# EAGLE design pll_board (EAGLE 8.3.0)
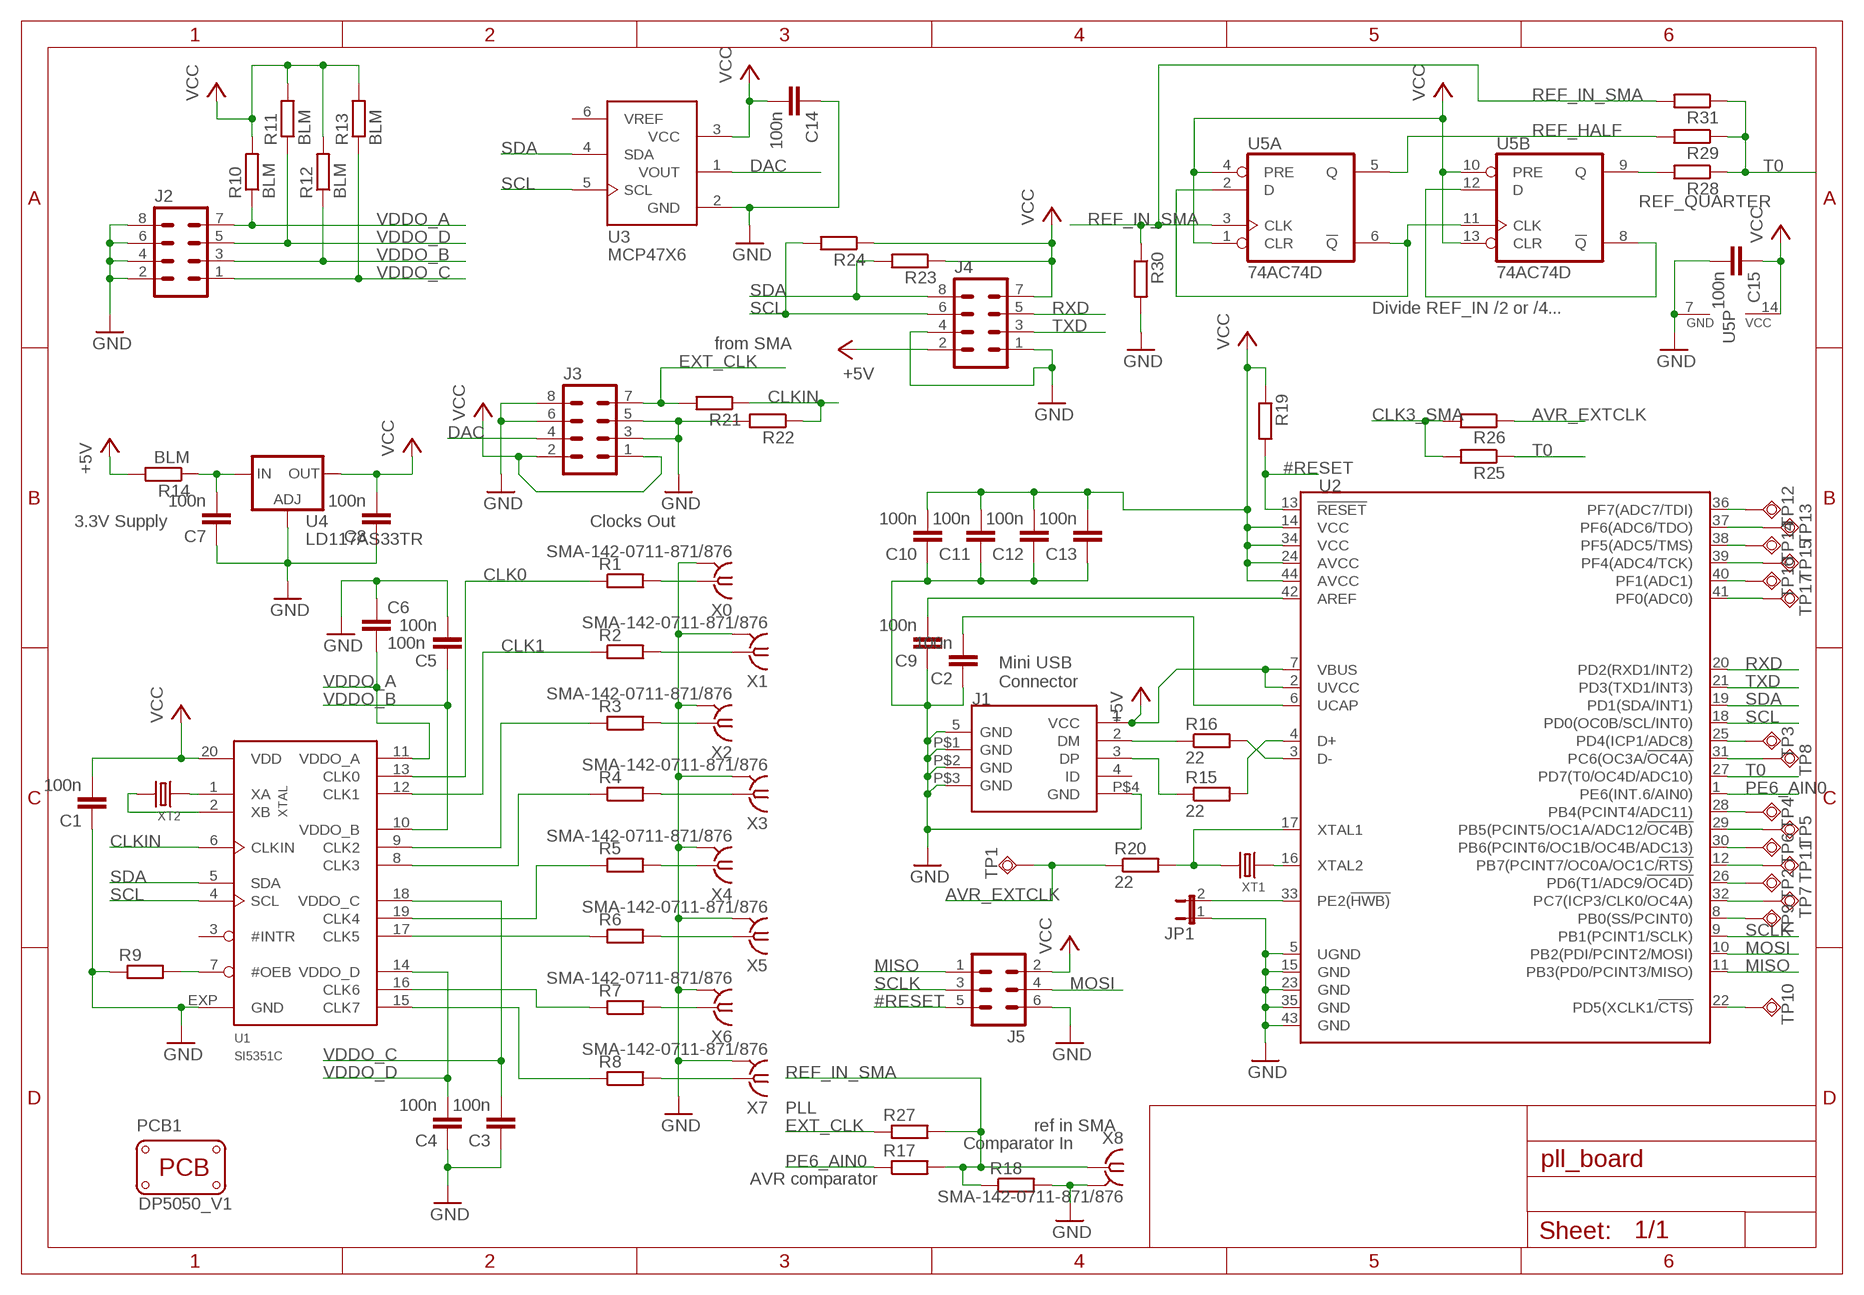
[diagram p0: schematic, sheet 1]

## Parts
C1  100n  C-EUC0805  [C0805]
C2  100n  C-EUC0805  [C0805]
C3  100n  C-EUC0805  [C0805]
C4  100n  C-EUC0805  [C0805]
C5  100n  C-EUC0805  [C0805]
C6  100n  C-EUC0805  [C0805]
C7  100n  C-EUC0805  [C0805]
C8  100n  C-EUC0805  [C0805]
C9  100n  C-EUC0805  [C0805]
C10  100n  C-EUC0805  [C0805]
C11  100n  C-EUC0805  [C0805]
C12  100n  C-EUC0805  [C0805]
C13  100n  C-EUC0805  [C0805]
C14  100n  C-EUC0805  [C0805]
C15  100n  C-EUC0805  [C0805]
J1  MINI-USB-RCPT-B-5PS-R/A-SMD(ST-USB-002A)  [MINIUSB5+4P-SMD-0.8-90D]
J2  MA04-2  [MA04-2]
J3  MA04-2  [MA04-2]
J4  MA04-2  [MA04-2]
J5  MA03-2  [MA03-2]
JP1  JP1E  [JP1]
PCB1  PCB_DP_SQUARE-5X5  [DP5050_V1]
R1  R-EU_R0805  [R0805]
R2  R-EU_R0805  [R0805]
R3  R-EU_R0805  [R0805]
R4  R-EU_R0805  [R0805]
R5  R-EU_R0805  [R0805]
R6  R-EU_R0805  [R0805]
R7  R-EU_R0805  [R0805]
R8  R-EU_R0805  [R0805]
R9  R-EU_R0805  [R0805]
R10  BLM  R-EU_R0805  [R0805]
R11  BLM  R-EU_R0805  [R0805]
R12  BLM  R-EU_R0805  [R0805]
R13  BLM  R-EU_R0805  [R0805]
R14  BLM  R-EU_R0805  [R0805]
R15  22  R-EU_R0805  [R0805]
R16  22  R-EU_R0805  [R0805]
R17  R-EU_R0805  [R0805]
R18  R-EU_R0805  [R0805]
R19  R-EU_R0805  [R0805]
R20  22  R-EU_R0805  [R0805]
R21  R-EU_R0805  [R0805]
R22  R-EU_R0805  [R0805]
R23  R-EU_R0805  [R0805]
R24  R-EU_R0805  [R0805]
R25  R-EU_R0805  [R0805]
R26  R-EU_R0805  [R0805]
R27  R-EU_R0805  [R0805]
R28  R-EU_R0805  [R0805]
R29  R-EU_R0805  [R0805]
R30  R-EU_R0805  [R0805]
R31  R-EU_R0805  [R0805]
TP1  TPSQB1,27  [B1,27]
TP2  TPSQB1,27  [B1,27]
TP3  TPSQB1,27  [B1,27]
TP4  TPSQB1,27  [B1,27]
TP5  TPSQB1,27  [B1,27]
TP6  TPSQB1,27  [B1,27]
TP7  TPSQB1,27  [B1,27]
TP8  TPSQB1,27  [B1,27]
TP9  TPSQB1,27  [B1,27]
TP10  TPSQB1,27  [B1,27]
TP11  TPSQB1,27  [B1,27]
TP12  TPSQB1,27  [B1,27]
TP13  TPSQB1,27  [B1,27]
TP14  TPSQB1,27  [B1,27]
TP15  TPSQB1,27  [B1,27]
TP16  TPSQB1,27  [B1,27]
TP17  TPSQB1,27  [B1,27]
U1  SI5351C  [QFN20]
U2  MCU-ATMEGA32U4(TQFP44)-AU  [TQFP44-0.8-9.6X9.6MM]
U3  MCP47X6  [SOT23-6]
U4  LD117AS33TR  [SOT223]
U5  74AC74D  [SO14]
X0  SMA-142-0711-871/876  [J502-ND-142-0711-871/876]
X1  SMA-142-0711-871/876  [J502-ND-142-0711-871/876]
X2  SMA-142-0711-871/876  [J502-ND-142-0711-871/876]
X3  SMA-142-0711-871/876  [J502-ND-142-0711-871/876]
X4  SMA-142-0711-871/876  [J502-ND-142-0711-871/876]
X5  SMA-142-0711-871/876  [J502-ND-142-0711-871/876]
X6  SMA-142-0711-871/876  [J502-ND-142-0711-871/876]
X7  SMA-142-0711-871/876  [J502-ND-142-0711-871/876]
X8  SMA-142-0711-871/876  [J502-ND-142-0711-871/876]
XT1  CRYSTAL'3225'  [X4-SMD-3.2X2.5X0.7MM]
XT2  CRYSTAL'3225'  [X4-SMD-3.2X2.5X0.7MM]

## Nets
#OEB: R9.2 U1.7(#OEB)
#RESET: J5.5 R19.2 U2.13(!RESET)
+5V: J1.1(VCC) J4.2 R14.2 U2.2(UVCC) U2.7(VBUS)
AREF: C9.2 U2.42(AREF)
AVR_EXTCLK: R20.1 R26.1 TP1.TP
CLK0: R1.1 U1.13(CLK0)
CLK0_SMA: R1.2 X0.1
CLK1: R2.1 U1.12(CLK1)
CLK1_SMA: R2.2 X1.1
CLK2: R3.1 U1.9(CLK2)
CLK2_SMA: R3.2 X2.1
CLK3: R4.1 U1.8(CLK3)
CLK3_SMA: R4.2 R25.2 R26.2 X3.1
CLK4: R5.1 U1.19(CLK4)
CLK4_SMA: R5.2 X4.1
CLK5: R6.1 U1.17(CLK5)
CLK5_SMA: R6.2 X5.1
CLK6: R7.1 U1.16(CLK6)
CLK6_SMA: R7.2 X6.1
CLK7: R8.1 U1.15(CLK7)
CLK7_SMA: R8.2 X7.1
CLKIN: R21.1 R22.1 U1.6(CLKIN)
DAC: J3.4 U3.1(VOUT)
EXT_CLK: J3.7 R21.2 R27.1
GND: C1.1 C2.1 C3.1 C4.1 C5.2 C6.1 C7.1 C8.1 C9.1 C10.1 C11.1 C12.1 C13.1 C14.1 C15.2 J1.5(GND) J1.P$1(GND) J1.P$2(GND) J1.P$3(GND) J1.P$4(GND) J2.2 J2.4 J2.6 J2.8 J3.3 J3.5 J3.6 J3.8 J4.1 J4.4 J5.6 JP1.1 R9.1 R18.2 R22.2 R30.2 U1.EXP(GND) U2.5(UGND) U2.15(GND) U2.23(GND) U2.35(GND) U2.43(GND) U3.2(GND) U4.1(ADJ) U5.7(P:GND) X0.G@1 X0.G@2 X0.G@3 X0.G@4 X1.G@1 X1.G@2 X1.G@3 X1.G@4 X2.G@1 X2.G@2 X2.G@3 X2.G@4 X3.G@1 X3.G@2 X3.G@3 X3.G@4 X4.G@1 X4.G@2 X4.G@3 X4.G@4 X5.G@1 X5.G@2 X5.G@3 X5.G@4 X6.G@1 X6.G@2 X6.G@3 X6.G@4 X7.G@1 X7.G@2 X7.G@3 X7.G@4 X8.G@1 X8.G@2 X8.G@3 X8.G@4
LDO_IN: C7.2 R14.1 U4.3(IN)
MISO: J5.1 U2.11(PB3(PD0/PCINT3/MISO))
MOSI: J5.4 U2.10(PB2(PDI/PCINT2/MOSI))
N$1: U2.16(XTAL2) XT1.2
N$2: U1.1(XA) XT2.2
N$3: R20.2 U2.17(XTAL1) XT1.4
N$5: JP1.2 U2.33(PE2(!HWB))
N$11: U1.2(XB) XT2.4
P8: TP9.TP U2.8(PB0(SS/PCINT0))
P12: TP11.TP U2.12(PB7(PCINT7/OC0A/OC1C/!RTS))
P22: TP10.TP U2.22(PD5(XCLK1/!CTS))
P25: TP3.TP U2.25(PD4(ICP1/ADC8))
P26: TP2.TP U2.26(PD6(T1/ADC9/!OC4D))
P28: TP4.TP U2.28(PB4(PCINT4/ADC11))
P29: TP5.TP U2.29(PB5(PCINT5/OC1A/ADC12/!OC4B))
P30: TP6.TP U2.30(PB6(PCINT6/OC1B/OC4B/ADC13))
P31: TP8.TP U2.31(PC6(OC3A/!OC4A))
P32: TP7.TP U2.32(PC7(ICP3/CLK0/OC4A))
P36: TP12.TP U2.36(PF7(ADC7/TDI))
P37: TP13.TP U2.37(PF6(ADC6/TDO))
P38: TP14.TP U2.38(PF5(ADC5/TMS))
P39: TP15.TP U2.39(PF4(ADC4/TCK))
P40: TP16.TP U2.40(PF1(ADC1))
P41: TP17.TP U2.41(PF0(ADC0))
PE6_AIN0: R17.1 U2.1(PE6(INT.6/AIN0))
REF_HALF: R29.2 U5.5(A:Q)
REF_HALF_N: U5.2(A:D) U5.6(A:!Q) U5.11(B:CLK)
REF_IN_SMA: R17.2 R18.1 R27.2 R30.1 R31.2 U5.3(A:CLK) X8.1
REF_QUARTER: R28.2 U5.9(B:Q)
REF_QUARTER_N: U5.8(B:!Q) U5.12(B:D)
RXD: J4.5 U2.20(PD2(RXD1/INT2))
SCL: J4.6 R24.2 U1.4(SCL) U2.18(PD0(OC0B/SCL/INT0)) U3.5(SCL)
SCLK: J5.3 U2.9(PB1(PCINT1/SCLK))
SDA: J4.8 R23.2 U1.5(SDA) U2.19(PD1(SDA/INT1)) U3.4(SDA)
T0: R25.1 R28.1 R29.1 R31.1 U2.27(PD7(T0/OC4D/ADC10))
TXD: J4.3 U2.21(PD3(TXD1/INT3))
UCAP: C2.2 U2.6(UCAP)
USBD_CON_N: J1.2(DM) R16.1
USBD_CON_P: J1.3(DP) R15.1
USBD_N: R16.2 U2.3(D-)
USBD_P: R15.2 U2.4(D+)
VCC: C1.2 C8.2 C10.2 C11.2 C12.2 C13.2 C14.2 C15.1 J3.1 J3.2 J4.7 J5.2 R10.2 R11.2 R12.2 R13.2 R19.1 R23.1 R24.1 U1.20(VDD) U2.14(VCC) U2.24(AVCC) U2.34(VCC) U2.44(AVCC) U3.3(VCC) U4.4(OUT) U5.1(A:CLR) U5.4(A:PRE) U5.10(B:PRE) U5.13(B:CLR) U5.14(P:VCC)
VDDO_A: C6.2 J2.7 R10.1 U1.11(VDDO_A)
VDDO_B: C5.1 J2.3 R12.1 U1.10(VDDO_B)
VDDO_C: C3.2 J2.1 R13.1 U1.18(VDDO_C)
VDDO_D: C4.2 J2.5 R11.1 U1.14(VDDO_D)
Unconnected: J1.4(ID) U1.3(#INTR) U3.6(VREF)

## Notes on the sheet
- Divide REF_IN /2 or /4...
- from SMA
- 3.3V Supply | Clocks Out
- Mini USB
  Connector
- PLL
- ref in SMA
- Comparator In
- AVR comparator

## Library data of the parts
C1-C15 = rcl:C-EU: CAPACITOR, European symbol
J1 = OPL-Connector:MINI-USB-RCPT-B-5PS-R/A-SMD(ST-USB-002A): 320010013; MPN: ST-USB-002A
J2-J4 = con-lstb:MA04-2: PIN HEADER; OC_FARNELL: unknown; OC_NEWARK: unknown
J5 = con-lstb:MA03-2: PIN HEADER; OC_FARNELL: unknown; OC_NEWARK: unknown
JP1 = jumper:JP1E: JUMPER
PCB1 = dp_devices:PCB_DP_SQUARE: Dangerous Prototypes Standard Square PCB sizes; PCB_SIZE: DP5050_V1
R1-R31 = rcl:R-EU_: RESISTOR, European symbol
TP1-TP17 = testpad:TPSQ: Test pad
U1 = cvogel:SI5351C: Si5351 Any-Frequency CMOS Clock Generators Generates up to 8 non-integer frequencies from 8 kHz to 133 MHz I²C user definable configuration Exact frequency synthesis at each output (0 ppm error) Highly linear VCXO Optional clock input (CLKIN) Low output period jitter: 100 ps pp Configurable spread spectrum selectable at each output Operates from a low-cost, fixed frequency crystal: 25 or 27 MHz Glitchless frequency changes Separate voltage supply pins: Core VDD: 2.5 V or 3.3 V Output VDDO: 2.5 V or 3.3 V Excellent PSRR eliminates external power supply filtering Very low power consumption Adjustable output-output delay Available in 3 packages types: 10-MSOP: 3 outputs 24-QSOP: 8 outputs 20-QFN (4x4 mm): 8 outputs
U2 = OPL-ic:MCU-ATMEGA32U4(TQFP44): 310010010; DESCRIPTION: IC-MCU-8Bit-32KB-ISP-flash&USB-controller-16MHz-2.7v-5.5v
U3 = cvogel:MCP47X6: MCP4706/4716/4726 8-/10-/12-Bit Voltage Output Digital-to-Analog Converter with EEPROM and I2C Interface • Output Voltage Resolutions - 12-bit: MCP4726 - 10-bit: MCP4716 - 8-bit: MCP4706 • Rail-to-Rail Output
U4 = v-reg:LD117A?*: Low drop fixed and adjustable positive voltage regulators 1 A Source: http://www.st.com/stonline/products/literature/ds/7194/ld1117axx.pdf
U5 = 74xx-eu:74*74: Dual D type positive edge triggered FLIP FLOP, preset and clear
X0 X1-X8 = con-coax:SMA-: SMA 50 Ohm End Launch Jack Receptacle - Round Contact Johnson Components Source: www.johnsoncomponents.com .. J502-ND.pdf; MF: JOHNSON COMPONENTS; MPN: 142-0711-871; OC_FARNELL: unknown; OC_NEWARK: 01C1639
XT1 XT2 = OPL-crystal-osctllator:CRYSTAL

## Board
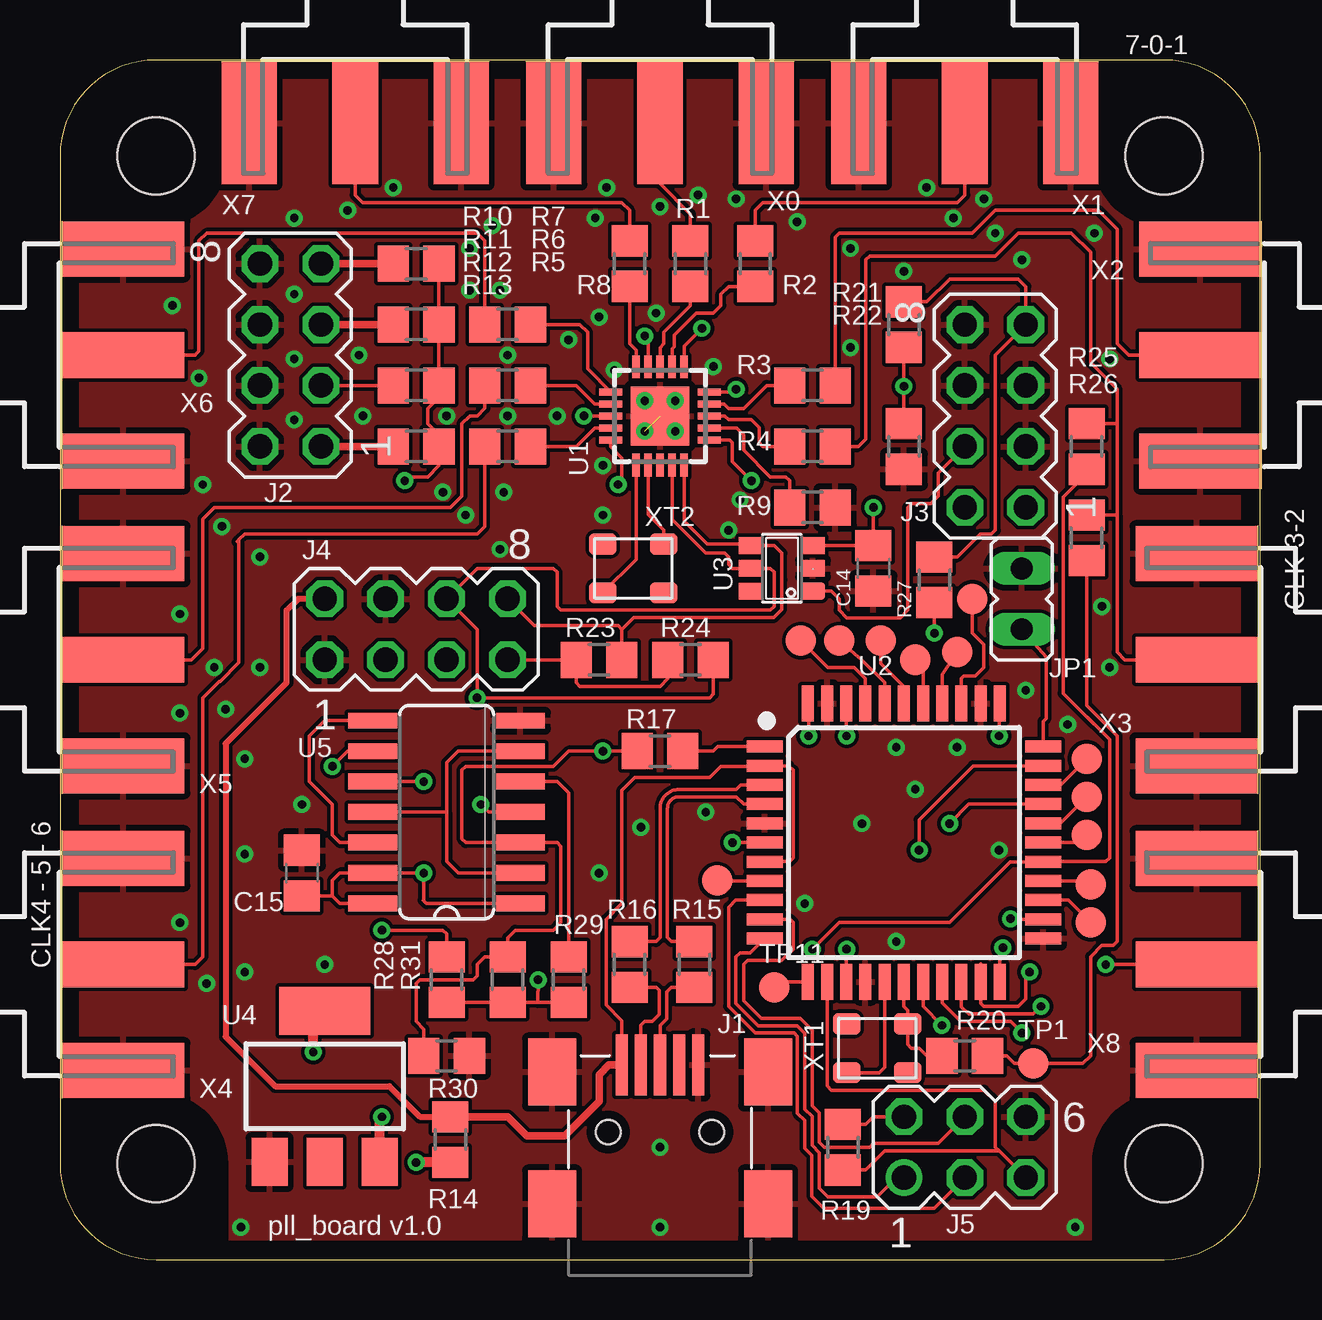
[diagram p1: board, top side]
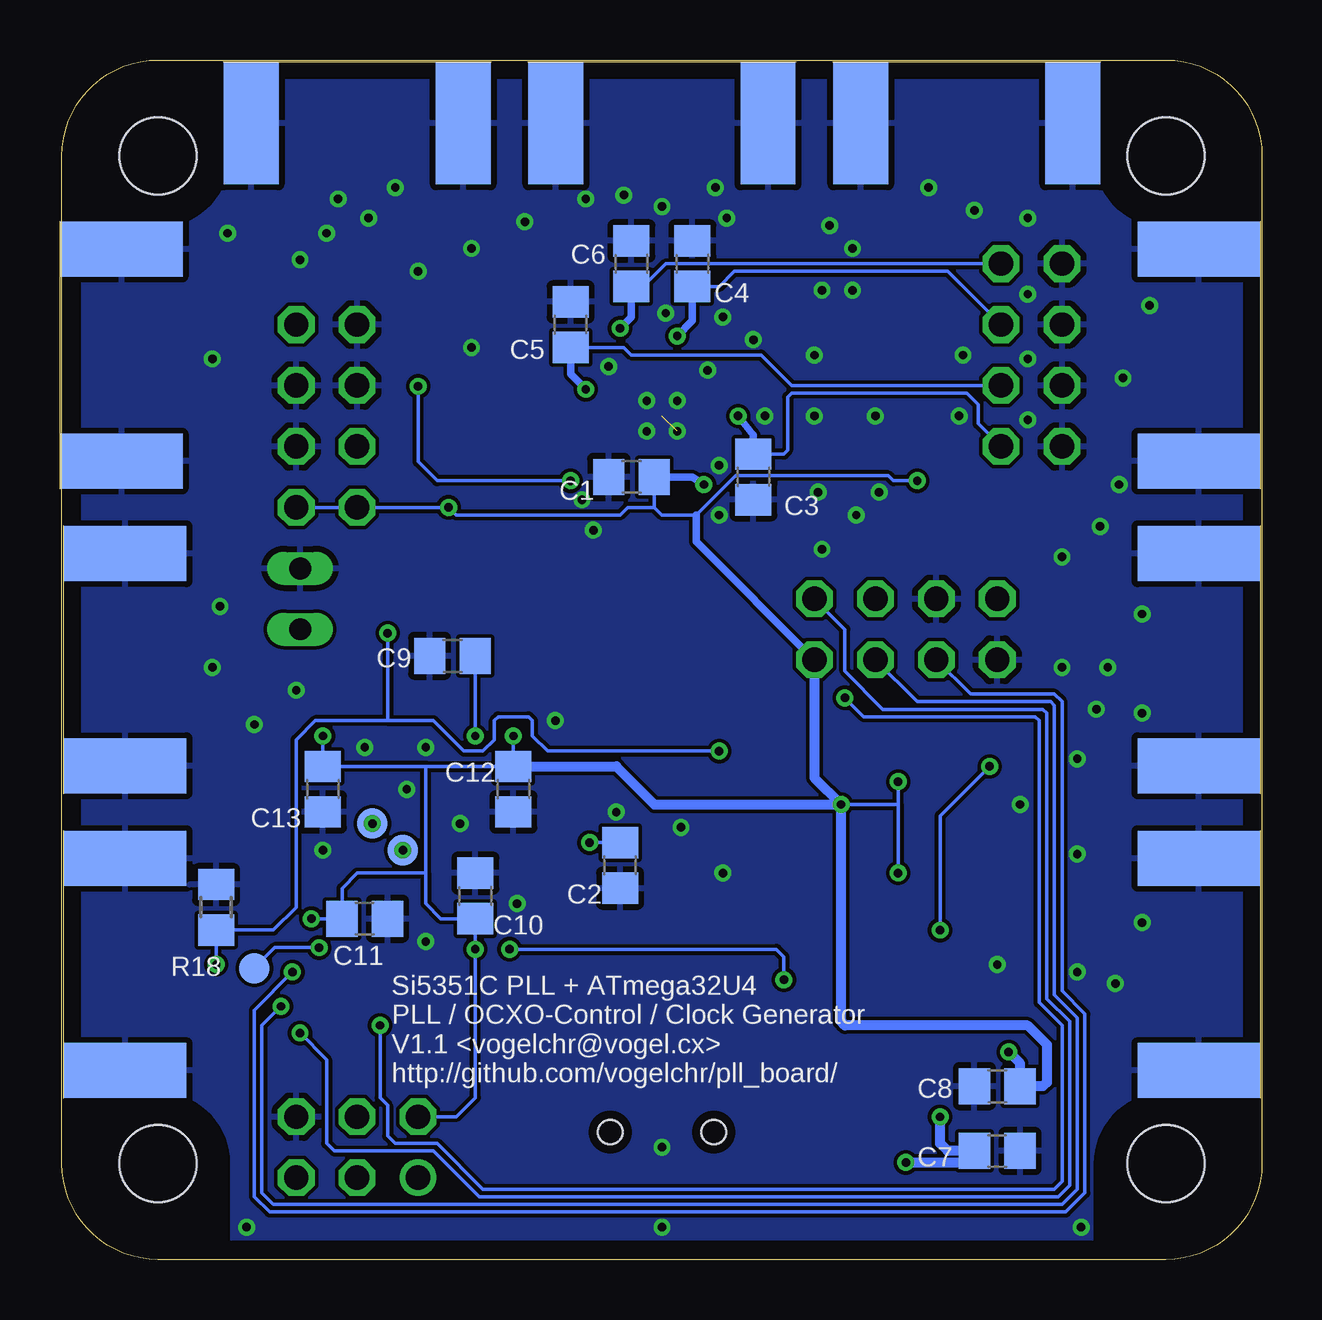
[diagram p2: board, bottom side, seen from below]

Size 50.08 x 50 mm. Coordinates in mm from the lower left corner, seen from the top.
Copper layers (1*16): Top 0.0356mm / dielectric 1.5011mm / Bottom 0.0356mm
Design rules "oshpark-2layer *": minimum track width 6mil, minimum drill 13mil, track to track 6mil, track to pad 6mil, pad to pad 6mil, via to via 6mil, smd to smd 6mil, copper to edge 15mil, drill to drill 6mil, minimum pad ring 7mil, minimum via ring 7mil, stop-mask expansion 2.5mil, vias tented up to drill 14mil, thermal gap 10mil

### Footprints (pad centres in the part's own frame; a part is rotated, then mirrored left to right if it is on the bottom)
C0805 = smd 1.3 x 1.5: 1 -0.95,0; 2 0.95,0
MINIUSB5+4P-SMD-0.8-90D = smd 2.54 x 0.508: 1 0.381,-1.6; 2 0.381,-0.8; 3 0.381,0; 4 0.381,0.8; 5 0.381,1.6 | smd 2.794 x 2: P$1 6.175,4.5; P$2 6.175,-4.5; P$3 0.675,4.5; P$4 0.675,-4.5 | hole 1.016: 3.175,-2.159; 3.175,2.159
MA04-2 = drill 1.016 octagon: 1 -3.81,-1.27; 2 -3.81,1.27; 3 -1.27,-1.27; 4 -1.27,1.27; 5 1.27,-1.27; 6 1.27,1.27; 7 3.81,-1.27; 8 3.81,1.27
MA03-2 = drill 1.016: 1 -2.54,-1.27 | drill 1.016 octagon: 2 -2.54,1.27; 3 0,-1.27; 4 0,1.27; 5 2.54,-1.27; 6 2.54,1.27
JP1 = drill 0.914 long: 1 0,-1.27; 2 0,1.27
DP5050_V1 = hole 3.2: -21,-21; 21,-21; 21,21; -21,21
R0805 = smd 1.3 x 1.5: 1 -0.95,0; 2 0.95,0
B1,27 = smd 1.27 x 1.27: TP 0,0
QFN20 = smd 0.95 x 0.3: 1 -2.05,1; 2 -2.05,0.5; 3 -2.05,0; 4 -2.05,-0.5; 5 -2.05,-1; 11 2.05,-1; 12 2.05,-0.5; 13 2.05,0; 14 2.05,0.5; 15 2.05,1 | smd 0.3 x 0.95: 6 -1,-2.05; 7 -0.5,-2.05; 8 0,-2.05; 9 0.5,-2.05; 10 1,-2.05; 16 1,2.05; 17 0.5,2.05; 18 0,2.05; 19 -0.5,2.05; 20 -1,2.05 | smd 2.45 x 2.45: EXP 0,0
TQFP44-0.8-9.6X9.6MM = smd 1.5 x 0.5: 1 -5.8,4; 2 -5.8,3.2; 3 -5.8,2.4; 4 -5.8,1.6; 5 -5.8,0.8; 6 -5.8,0; 7 -5.8,-0.8; 8 -5.8,-1.6; 9 -5.8,-2.4; 10 -5.8,-3.2; 11 -5.8,-4; 23 5.8,-4; 24 5.8,-3.2; 25 5.8,-2.4; 26 5.8,-1.6; 27 5.8,-0.8; 28 5.8,0; 29 5.8,0.8; 30 5.8,1.6; 31 5.8,2.4; 32 5.8,3.2; 33 5.8,4 | smd 0.5 x 1.5: 12 -4,-5.8; 13 -3.2,-5.8; 14 -2.4,-5.8; 15 -1.6,-5.8; 16 -0.8,-5.8; 17 0,-5.8; 18 0.8,-5.8; 19 1.6,-5.8; 20 2.4,-5.8; 21 3.2,-5.8; 22 4,-5.8; 34 4,5.8; 35 3.2,5.8; 36 2.4,5.8; 37 1.6,5.8; 38 0.8,5.8; 39 0,5.8; 40 -0.8,5.8; 41 -1.6,5.8; 42 -2.4,5.8; 43 -3.2,5.8; 44 -4,5.8
SOT23-6 = smd 0.711 x 1.016: 1 -0.95,-1.29 | smd 0.69 x 0.99: 2 0,-1.29; 3 0.95,-1.29; 4 0.95,1.3; 5 0,1.3; 6 -0.95,1.3
SOT223 = smd 1.5 x 2: 1 -2.3,-3.15; 2 0,-3.15; 3 2.3,-3.15 | smd 3.8 x 2: 4 0,3.15
SO14 = smd 0.66 x 2.032: 1 -3.81,-3.073; 2 -2.54,-3.073; 3 -1.27,-3.073; 4 0,-3.073; 5 1.27,-3.073; 6 2.54,-3.073; 7 3.81,-3.073; 8 3.81,3.073; 9 2.54,3.073; 10 1.27,3.073; 11 0,3.073; 12 -1.27,3.073; 13 -2.54,3.073; 14 -3.81,3.073
J502-ND-142-0711-871/876 = smd 5.08 x 1.905: 1 2.565,0 | smd 5.08 x 2.286: G@1 2.565,4.42; G@2 2.565,-4.42 | smd 5.08 x 2.286 bottom: G@3 2.565,4.42; G@4 2.565,-4.42
X4-SMD-3.2X2.5X0.7MM = smd 1.143 x 0.889: 1 -1.27,1.016; 2 -1.27,-1.016; 3 1.27,-1.016; 4 1.27,1.016

### Placement (x,y rotation side)
C1  26.27,32.62 0 bottom
C2  26.75,16.43 90 bottom
C3  21.19,32.62 90 bottom
C4  23.73,41.51 270 bottom
C5  28.81,38.97 90 bottom
C6  26.27,41.51 270 bottom
C7  11.03,4.52 180 bottom
C8  11.03,7.22 0 bottom
C9  33.73,25.16 0 bottom
C10  32.78,15.16 270 bottom
C11  37.38,14.2 180 bottom
C12  31.19,19.6 90 bottom
C13  39.13,19.6 90 bottom
C14  33.89,28.81 90 top
C15  10.08,16.11 90 top
J1  25,8.49 270 top
J2  9.6,37.7 90 top
J3  38.97,35.16 90 top
J4  14.84,26.27 0 top
J5  37.7,4.68 0 top
JP1  40.08,27.54 180 top
PCB1  25,25 0 top
R1  26.27,41.51 90 top
R2  28.97,41.51 90 top
R3  31.35,36.43 0 top
R4  31.35,33.89 0 top
R5  18.65,33.89 180 top
R6  18.65,36.43 180 top
R7  18.65,38.97 180 top
R8  23.73,41.51 90 top
R9  31.35,31.35 180 top
R10  14.84,41.51 0 top
R11  14.84,38.97 0 top
R12  14.84,36.43 0 top
R13  14.84,33.89 0 top
R14  16.27,5 90 top
R15  26.43,12.3 90 top
R16  23.73,12.3 90 top
R17  25,21.19 180 top
R18  43.57,14.68 90 bottom
R19  32.62,4.68 270 top
R20  37.7,8.49 180 top
R21  35.16,38.97 90 top
R22  35.16,33.89 270 top
R23  22.46,25 0 top
R24  26.27,25 0 top
R25  42.78,33.89 90 top
R26  42.78,30.08 90 top
R27  36.43,28.33 270 top
R28  16.11,11.66 90 top
R29  21.19,11.66 90 top
R30  16.11,8.49 0 top
R31  18.65,11.66 90 top
TP1  40.56,8.17 0 top
TP2  42.94,15.63 0 top
TP3  42.94,14.05 0 top
TP4  42.78,17.7 0 top
TP5  42.78,19.28 0 top
TP6  37.06,18.17 0 bottom
TP7  35.8,17.06 0 bottom
TP8  42.78,20.87 0 top
TP9  27.38,15.79 0 top
TP10  41.99,12.14 0 bottom
TP11  29.76,11.35 0 top
TP12  38.02,27.54 0 top
TP13  37.38,25.32 0 top
TP14  35.64,25 0 top
TP15  34.21,25.79 0 top
TP16  32.46,25.79 0 top
TP17  30.87,25.79 0 top
U1  25,35.16 90 top
U2  35.16,17.38 0 top
U3  30.08,28.81 90 top
U4  11.03,7.22 0 top
U5  16.11,18.65 90 top
X0  25,49.92 270 top
X1  37.7,49.92 270 top
X2  50.08,37.7 180 top
X3  49.92,25 180 top
X4  0.08,12.3 0 top
X5  0.08,25 0 top
X6  0.08,37.7 0 top
X7  12.3,49.92 270 top
X8  49.92,12.3 180 top
XT1  34.05,8.81 0 top
XT2  23.89,28.81 0 top

### Tracks (layer width: path | path; a pad name or v marks a point on that pad's centre or on a via)
#OEB
  Top 0.152: U1.7 28.2,34.66 28.49,34.37 28.49,33.73 29.6,32.62 30.24,32.62 30.4,32.46 R9.2
#RESET
  Top 0.152: R19.2 33.57,3.73 34.37,4.52 39.13,4.52 | 39.13,4.52 J5.5 | U2.13 31.96,7.24 32.14,7.06 38.49,7.06 38.97,6.58 38.97,4.68 39.13,4.52
+5V
  Top 0.152: U2.7 30.4,16.59 30.56,16.74 30.56,20.4 30.37,20.58 U2.2 29.33,20.55 27.54,20.55 27.07,20.08 23.94,20.08 23.41,19.56 23.41,14.84 22.75,14.18 22.75,10.6 23.4,9.96 J1.1
  Top 0.254: J4.2 9.92,27.54 9.44,27.06 9.44,24.05 8.57,23.17 | R14.2 15,5.95 13.73,7.22 8.97,7.22 6.9,9.28 6.9,21.51 8.57,23.17 | 8.49,23.09 8.57,23.17
  Top 0.305: J1.1 22.87,8.11 22.46,7.7 22.46,6.58 21.03,5.16 19.44,5.16 18.65,5.95 R14.2
AREF  (via drill 0.35)
  Top 0.152: 32.76,22.6 U2.42 32.76,21.84 v32.78,21.82
  Bottom 0.152: v32.78,21.82 C9.2
AVR_EXTCLK
  Top 0.152: R20.1 39.45,8.49 39.76,8.17 TP1.TP 42.62,8.17 42.94,8.49 42.94,12.62 43.41,13.09 43.89,13.09 44.05,13.25 44.05,21.82 42.78,23.09 R26.1
CLK0
  Top 0.152: U1.13 25,38.02 25.16,38.18 25.16,38.65 26.27,39.76 R1.1
CLK0_SMA
  Top 0.152: X0.1 25,44.84 26.27,43.57 R1.2
CLK1
  Top 0.152: U1.12 25.5,37.96 25.6,38.06 25.6,38.54 26.51,39.45 27.22,39.45 27.54,39.76 27.54,40.24 27.86,40.56 R2.1
CLK1_SMA
  Top 0.152: R2.2 28.97,43.73 29.29,44.05 37.38,44.05 37.7,44.37 X1.1
CLK2
  Top 0.152: U1.9 27.67,35.66 27.86,35.48 28.49,35.48 29.44,36.43 R3.1
CLK2_SMA
  Top 0.152: X2.1 44.53,37.7 44.05,38.18 44.05,42.94 43.26,43.73 38.97,43.73 38.02,42.78 32.46,42.78 32.3,42.62 R3.2
CLK3
  Top 0.152: U1.8 27.7,35.16 27.86,35 28.81,35 29.13,34.68 29.13,34.05 29.29,33.89 R4.1
CLK3_SMA
  Top 0.152: R4.2 33.25,33.89 33.57,34.21 33.57,41.67 33.73,41.83 38.97,41.83 39.92,42.78 42.14,42.78 42.94,41.99 42.94,37.38 44.05,36.27 44.05,34.84 | 44.05,31.01 44.05,34.84 | 44.05,31.01 44.05,25.32 44.37,25 X3.1 | R25.2 44.05,34.84 | R26.2 44.03,31.03 44.05,31.01
CLK4
  Top 0.152: U1.19 22.28,34.66 21.51,33.89 R5.1
CLK4_SMA
  Top 0.152: 7.38,29.92 7.46,30 | 7.46,30 7.7,30.24 17.38,30.24 17.7,30.56 R5.2 | 7.46,30 7.46,24.89 6.67,24.1 6.64,24.1 5.95,23.41 5.95,12.62 5.63,12.3 X4.1
CLK5
  Top 0.152: U1.17 22.28,35.66 21.51,36.43 R6.1
CLK5_SMA
  Top 0.152: 17.7,36.11 R6.2 17.7,35.48 17.38,35.16 17.06,35.16 16.74,34.84 16.74,31.83 16.27,31.35 6.43,31.35 5.95,30.87 5.95,25.48 5.47,25 X5.1
CLK6
  Top 0.152: 22.94,36.17 U1.16 21.98,37.13 21.98,38.65 21.67,38.97 R7.1
CLK6_SMA
  Top 0.152: 5.62,37.7 X6.1 | 5.62,37.7 5.63,37.7 | R7.2 17.7,42.46 17.38,42.78 6.11,42.78 5.79,42.46 5.79,37.87 5.62,37.7
CLK7
  Top 0.152: U1.15 24,37.91 23.73,38.18 R8.1
CLK7_SMA
  Top 0.152: X7.1 12.3,44.37 12.62,44.05 23.41,44.05 23.73,43.73 R8.2
CLKIN  (via drill 0.35)
  Top 0.152: R22.1 v35.16,36.4 R21.1 | U1.6 27.9,34.16 28.02,34.05 28.02,33.25 v28.81,32.46
  Bottom 0.152: v28.81,32.46 34.37,32.46 35.16,33.25 v35.16,36.4
DAC
  Top 0.152: U3.1 32.14,27.86 32.46,27.54 32.46,27.06 32.78,26.75 35,26.75 35.32,27.06 35.32,31.35 35.48,31.51 36.27,31.51 36.59,31.83 36.59,32.78 J3.4
EXT_CLK
  Top 0.152: R21.2 36.11,39.92 37.06,40.88 39.92,40.88 40.24,40.56 J3.7 38.97,37.7 38.97,30.4 38.81,30.24 38.34,30.24 37.38,29.28 R27.1
GND  (via drill 0.35)  (1 unrouted)
  other vias: 24.36,35.8 25.63,34.52 13.89,44.68 11.98,43.73 9.76,43.41 22.78,44.68 22.3,43.41 25,43.89 26.59,44.37 36.11,44.68 38.49,44.21 37.22,43.41 12.46,37.7 12.62,35.16 15.95,31.98 9.76,35 9.76,40.24 9.76,37.54 18.33,40.4 20.71,35.16 18.65,35.16 17.06,40.4 17.06,42.14 18.01,43.1 18.65,37.7 16.11,35.16 6.74,30.56 5,14.05 6.11,11.51 6.43,24.68 5,26.9 8.33,24.68 8.33,29.29 18.33,29.6 5.95,32.3 5.79,36.75 4.68,39.76 24.84,39.45 27.22,37.22 23.09,37.06 27.86,30.4 21.19,38.34 22.46,39.29 28.17,44.21 30.71,43.26 16.9,31.03 18.49,31.98 22.62,33.1 22.62,31.03 28.33,31.67 32.94,38.02 32.94,42.14 38.97,42.78 43.1,42.78 43.73,37.54 35.16,41.19 40.08,41.67 25.63,35.8 24.36,34.52 35.64,19.6 39.13,17.06 33.41,18.17 31.03,14.84 34.84,13.25 40.24,23.73 43.41,27.22 43.73,24.68 29.44,22.46 41.99,22.3 24.21,18.01 22.46,16.11 11.03,12.3 10.08,18.97 25,4.68 42.3,1.35 7.54,1.35 25,1.35 37.38,21.35 34.84,21.35 26.9,18.65 7.7,11.98 7.7,16.9 7.7,20.87 6.9,22.94 5,22.78
  pour Top: 2.14,49.13 47.86,49.13 49.13,47.86 49.13,2.14 47.86,0.87 2.14,0.87 0.87,2.14 0.87,47.86
  pour Bottom: 2.14,49.13 47.86,49.13 49.13,47.86 49.13,2.14 47.86,0.87 2.14,0.87 0.87,2.14 0.87,47.86
LDO_IN  (via drill 0.35)
  Top 0.152: v14.84,4.05 v14.84,4.04
  Top 0.406: U4.3 13.33,5.87 v13.41,5.95 | R14.1 v14.84,4.05
  Bottom 0.152: 12.46,4.04 C7.2
  Bottom 0.406: C7.2 13.09,4.52 13.41,4.84 v13.41,5.95 | v14.84,4.04 12.46,4.04
MISO
  Top 0.152: U2.11 28.76,12.78 28.33,12.78 28.16,12.6 28.16,10.68 29.1,9.74 30.72,9.74 31.03,9.43 31.03,6.27 31.34,5.96 31.34,4.76 31.64,4.45 31.64,2.96 31.98,2.62 34.05,2.62 34.84,3.41 J5.1
MOSI
  Top 0.152: U2.10 30.42,14.18 30.56,14.05 30.56,12.93 30.08,12.46 28.65,12.46 28.49,12.3 28.49,10.78 29.22,10.05 30.85,10.05 31.34,9.56 31.34,6.41 31.64,6.11 31.64,4.88 31.85,4.68 33.73,4.68 33.89,4.84 36.59,4.84 J5.4
N$1
  Top 0.152: U2.16 34.36,8.01 34.14,7.79 XT1.2
N$2
  Top 0.152: U1.1 24,29.17 XT2.2
N$3
  Top 0.152: U2.17 35.16,10.55 35.32,10.39 XT1.4 35.32,8.97 35.48,8.81 35.8,8.81 36.11,8.49 R20.2
N$5
  Top 0.152: U2.33 40.96,22.43 41.09,22.56 41.09,25.1 JP1.2
N$11
  Top 0.152: U1.2 24.5,31.06 25.16,30.4 XT2.4
P8
  Top 0.152: U2.8 27.39,15.78 TP9.TP
P12
  Top 0.152: U2.12 29.99,11.58 TP11.TP
P22  (via drill 0.35)
  Top 0.152: U2.22 39.16,12.87 v39.29,13
  Bottom 0.152: v39.29,13 41.13,13 TP10.TP
P25
  Top 0.152: U2.25 42,14.98 TP3.TP
P26
  Top 0.152: U2.26 42.79,15.78 TP2.TP
P28
  Top 0.152: U2.28 42.46,17.38 TP4.TP
P29
  Top 0.152: U2.29 41.67,18.18 TP5.TP
P30  (via drill 0.35)
  Top 0.152: U2.30 37.87,18.98 TP6.TP
  other vias: 37.06,18.17
P31
  Top 0.152: U2.31 41.69,19.78 TP8.TP
P32  (via drill 0.35)
  Top 0.152: TP7.TP 35.8,18.33 38.04,20.58 U2.32
  other vias: 35.8,17.06
P36
  Top 0.152: U2.36 37.56,24.22 37.66,24.32 38.13,24.32 38.49,24.68 38.49,25.63 38.02,26.11 TP12.TP
P37
  Top 0.152: U2.37 36.76,24.38 TP13.TP
P38
  Top 0.152: U2.38 35.96,24.68 TP14.TP
P39
  Top 0.152: U2.39 35.16,23.89 34.21,24.84 TP15.TP
P40
  Top 0.152: TP16.TP 33.41,25 34.37,24.05 U2.40
P41
  Top 0.152: U2.41 33.56,24.22 33.1,24.68 31.98,24.68 TP17.TP
PE6_AIN0
  Top 0.152: U2.1 27.41,21.38 27.22,21.19 R17.1
REF_HALF
  Top 0.152: U5.5 20.71,19.92 21.19,19.44 R29.2
REF_HALF_N
  Top 0.152: U5.6 16.59,21.19 16.11,20.71 16.11,18.64 | 16.11,18.64 16.11,16.59 16.59,16.11 U5.2 | U5.11 16.1,18.65 16.11,18.64
REF_IN_SMA  (via drill 0.35)
  Top 0.152: X8.1 v43.57,12.3 | R17.2 v22.62,21.19 21.19,21.19 20.55,20.55 16.9,20.55 16.74,20.4 16.74,17.54 16.9,17.38 U5.3 20.71,17.38 20.87,17.22 20.87,14.05 20.55,13.73 18.97,13.73 18.65,13.41 R31.2 17.69,12.61 17.38,12.3 17.38,11.82 17.22,11.66 15,11.66 14.84,11.51 14.84,9.92 15.16,9.6 R30.1 | R27.2 v36.43,26.11
  Bottom 0.152: v43.57,12.3 R18.1 41.19,13.73 40.24,14.68 40.24,21.67 39.45,22.46 36.4,22.46 | 36.4,22.46 34.52,22.46 33.25,21.19 32.46,21.19 31.98,21.67 31.98,22.46 31.83,22.62 30.56,22.62 30.4,22.46 30.4,21.82 29.76,21.19 v22.62,21.19 | v36.43,26.11 36.43,22.49 36.4,22.46
REF_QUARTER  (via drill 0.35)
  Top 0.152: U5.9 11.98,21.19 v11.35,20.55 | R28.2 16.11,13.57 15.95,13.73 v13.41,13.73
  Bottom 0.152: v13.41,13.73 13.41,18.49 v11.35,20.55
REF_QUARTER_N
  Top 0.152: U5.8 11.03,22.46 10.39,21.82 10.39,19.92 11.35,18.97 11.35,17.7 11.66,17.38 U5.12
RXD  (via drill 0.35)
  Top 0.152: U2.20 37.56,10.53 37.86,10.24 40.56,10.24 v40.88,10.55
  Bottom 0.152: v40.88,10.55 41.67,9.76 41.67,2.77 41.19,2.3 8.33,2.3 7.7,2.93 7.7,10.08 8.65,11.03 8.65,23.09 8.81,23.25 14.36,23.25 J4.5
SCL  (via drill 0.35)
  Top 0.152: U1.4 25.5,30.85 26.9,29.44 27.7,29.44 27.86,29.29 27.86,28.97 28.02,28.81 U3.5 29.6,28.81 29.76,28.65 29.76,27.22 29.6,27.06 20.87,27.06 20.71,27.22 20.71,28.65 20.55,28.81 17.38,28.81 J4.6 17.38,26.27 v17.38,23.41 27.06,23.41 27.22,23.57 R24.2 27.01,25 | U2.18 35.96,10.55 v36.75,9.76
  Bottom 0.152: v36.75,9.76 36.75,6.74 36.43,6.43 36.43,5.16 36.11,4.84 34.37,4.84 32.46,2.93 8.65,2.93 8.33,3.25 8.33,9.76 9.28,10.71 9.28,22.46 9.44,22.62 16.59,22.62 v17.38,23.41
SCLK
  Top 0.152: U2.9 28.16,14.98 27.86,14.68 27.86,10.55 28.97,9.44 30.59,9.44 30.73,9.31 30.73,6.09 31.03,5.79 31.03,4.63 31.33,4.34 31.33,2.64 31.41,2.55 | 31.41,2.55 31.35,2.62 | 31.41,2.55 31.83,2.14 36.43,2.14 J5.3
SDA  (via drill 0.35)
  Top 0.152: U1.5 26,30.78 26.96,29.82 27.61,29.82 27.62,29.82 28.72,29.82 U3.4 29.76,29.76 30.08,29.44 30.08,28.33 30.07,28.32 30.07,27.1 29.73,26.76 23.9,26.76 23.41,26.27 | U2.19 36.76,10.7 37.54,9.92 39.6,9.92 v40.08,9.44 | J4.8 19.76,26.43 23.25,26.43 23.41,26.27 | 23.41,26.27 R23.2
  Bottom 0.152: v40.08,9.44 38.97,8.33 38.97,4.84 38.65,4.52 34.52,4.52 32.62,2.62 8.49,2.62 8.01,3.09 8.01,9.92 8.97,10.87 8.97,22.78 9.12,22.94 15.79,22.94 17.38,24.52 17.38,26.27 J4.8
T0  (via drill 0.35)
  Top 0.152: 42.78,32.72 R25.1 42.78,32.75 41.8,31.77 41.8,23.6 43.73,21.67 | 43.73,21.67 43.73,16.74 43.57,16.59 U2.27 39.6,16.58 37.06,14.05 32.46,14.05 v31.35,12.93 | 42.49,22.92 43.73,21.67 | R28.1 R31.1 19.91,10.71 | 19.91,10.71 R29.1 | v19.92,11.66 19.91,10.71
  Bottom 0.152: v19.92,11.66 19.92,12.62 20.24,12.93 v31.35,12.93
TXD  (via drill 0.35)
  Top 0.152: 38.36,12.32 U2.21 38.36,10.69 38.49,10.55 39.92,10.55 40.24,10.87 40.24,11.82 v40.4,11.98
  Bottom 0.152: v40.4,11.98 41.99,10.39 41.99,2.62 41.35,1.98 8.17,1.98 7.38,2.77 7.38,10.24 8.33,11.19 8.33,23.25 8.65,23.57 12.14,23.57 J4.3
UCAP  (via drill 0.35)
  Top 0.152: U2.6 v28.02,17.38
  Bottom 0.152: v28.02,17.38 C2.2
USBD_CON_N
  Top 0.152: R16.1 24.84,11.35 24.97,11.21 24.97,10.21 24.68,9.92 24.36,9.92 24.21,9.76 J1.2
USBD_CON_P
  Top 0.152: R15.1 25.48,11.35 25.28,11.15 25.28,10.04 25,9.76 J1.3
USBD_N
  Top 0.152: U2.3 28.36,19.78 28.17,19.6 25.79,19.6 arc90 25.01,18.81 25.01,13.42 24.84,13.25 R16.2
USBD_P
  Top 0.152: U2.4 28.49,18.98 28.17,19.29 25.79,19.29 arc90 25.31,18.81 25.31,13.42 25.48,13.25 R15.2
VCC  (via drill 0.35)
  Top 0.152: R10.2 R11.2 R12.2 15.79,35.95 15.32,35.48 15.32,34.84 15.79,34.37 R13.2 15.79,33.09 15.32,32.62 14.52,32.62 v14.36,32.46 | U1.20 22.95,33.88 23.41,33.41 23.41,32.46 v23.25,32.3 | U2.14 32.76,12.92 v32.78,12.93 | U2.24 39.6,14.18 v39.6,14.2 | U2.34 39.13,23.18 v39.13,21.82 | U2.44 31.19,23.18 v31.19,21.82 | 10.55,9.89 U4.4 | R19.1 33.57,5.63 33.89,5.95 J5.2 | v33.89,31.35 C14.2 U3.3 | 21.47,25 J4.7 | 21.47,25 R23.1 | R24.1 25.32,24.21 25,23.89 21.67,23.89 21.51,24.05 21.51,24.96 21.47,25 | U5.10 v15.16,19.92 | 15.12,16.11 U5.13 11.66,16.11 11.35,15.79 11.35,15.16 | 15.12,16.11 v15.16,16.11 | 15.12,16.11 15.16,16.07 15.16,15 15.13,14.98 15.27,14.84 U5.1 | U5.14 11.66,14.84 11.35,15.16 | 11.35,15.16 C15.1 | U5.4 17.86,18.65 v17.54,18.97
  Top 0.406: v10.55,8.65 10.55,9.89
  Bottom 0.152: v14.36,32.46 15.36,32.46 15.57,32.67 21.93,32.67 23.57,31.03 25,31.03 25.32,31.35 | 25.32,31.35 C1.2 | v39.6,14.2 C11.2 38.33,15.48 37.7,16.11 34.88,16.11 34.84,16.07 | v39.13,21.82 C13.2 34.81,20.55 | v31.19,21.82 C12.2 34.81,20.55 | 34.84,16.07 34.84,14.84 34.21,14.21 C10.2 v32.78,12.93 32.78,6.74 33.57,5.95 J5.2 | 34.84,16.07 34.84,20.52 34.81,20.55 | 25.32,31.35 26.43,31.35 26.75,31.03 33.57,31.03 v33.89,31.35 J3.2 J3.1 | 15.16,19.01 v15.16,19.92 | 15.16,19.01 v15.16,16.11 | v17.54,18.97 15.2,18.97 15.16,19.01
  Bottom 0.305: C1.2 23.73,32.62 v23.25,32.3 | J4.7 23.57,29.92 23.57,31.03
  Bottom 0.406: v10.55,8.65 10.08,8.17 C8.2 9.12,7.22 8.97,7.38 8.97,8.97 9.76,9.76 17.38,9.76 17.54,9.92 v17.54,18.97 | J4.7 18.65,20.08 v17.54,18.97 | C12.2 26.9,20.55 25.32,18.97 v17.54,18.97
VDDO_A  (via drill 0.35)
  Top 0.152: U1.11 26,38.06 v26.75,38.81
  Top 0.305: J2.7 R10.1
  Bottom 0.152: C6.2 25.79,40.56 24.84,41.51 J2.7
  Bottom 0.305: C6.2 26.27,39.29 v26.75,38.81
VDDO_B  (via drill 0.35)
  Top 0.152: U1.10 27.9,36.16 v28.17,36.27 | R12.1 J2.3
  Bottom 0.152: C5.1 26.59,38.02 26.27,37.7 20.87,37.7 19.6,36.43 J2.3
  Bottom 0.305: C5.1 28.81,36.91 v28.17,36.27
VDDO_C  (via drill 0.35)
  Top 0.152: U1.18 v21.82,35.16
  Top 0.305: J2.1 R13.1
  Bottom 0.152: J2.1 11.82,34.84 11.82,35.64 12.3,36.11 19.6,36.11 19.76,35.95 19.76,33.73 19.92,33.57 C3.2
  Bottom 0.305: C3.2 21.19,34.37 v21.82,35.16
VDDO_D  (via drill 0.35)
  Top 0.152: U1.14 24.5,38.47 v24.36,38.49
  Top 0.305: J2.5 R11.1
  Bottom 0.152: J2.5 13.09,41.19 21.98,41.19 22.62,40.56 C4.2
  Bottom 0.305: C4.2 23.73,39.13 v24.36,38.49

### Text on the board
tNames: 7-0-1 | CLK-3-2 | CLK4 - 5 - 6 | pll_board v1.0
bNames: Si5351C PLL + ATmega32U4 / PLL / OCXO-Control / Clock Generator / V1.1 <vogelchr@vogel.cx> / http://github.com/vogelchr/pll_board/